# EAGLE design esp8266-lab-kit (EAGLE 7.5.0)
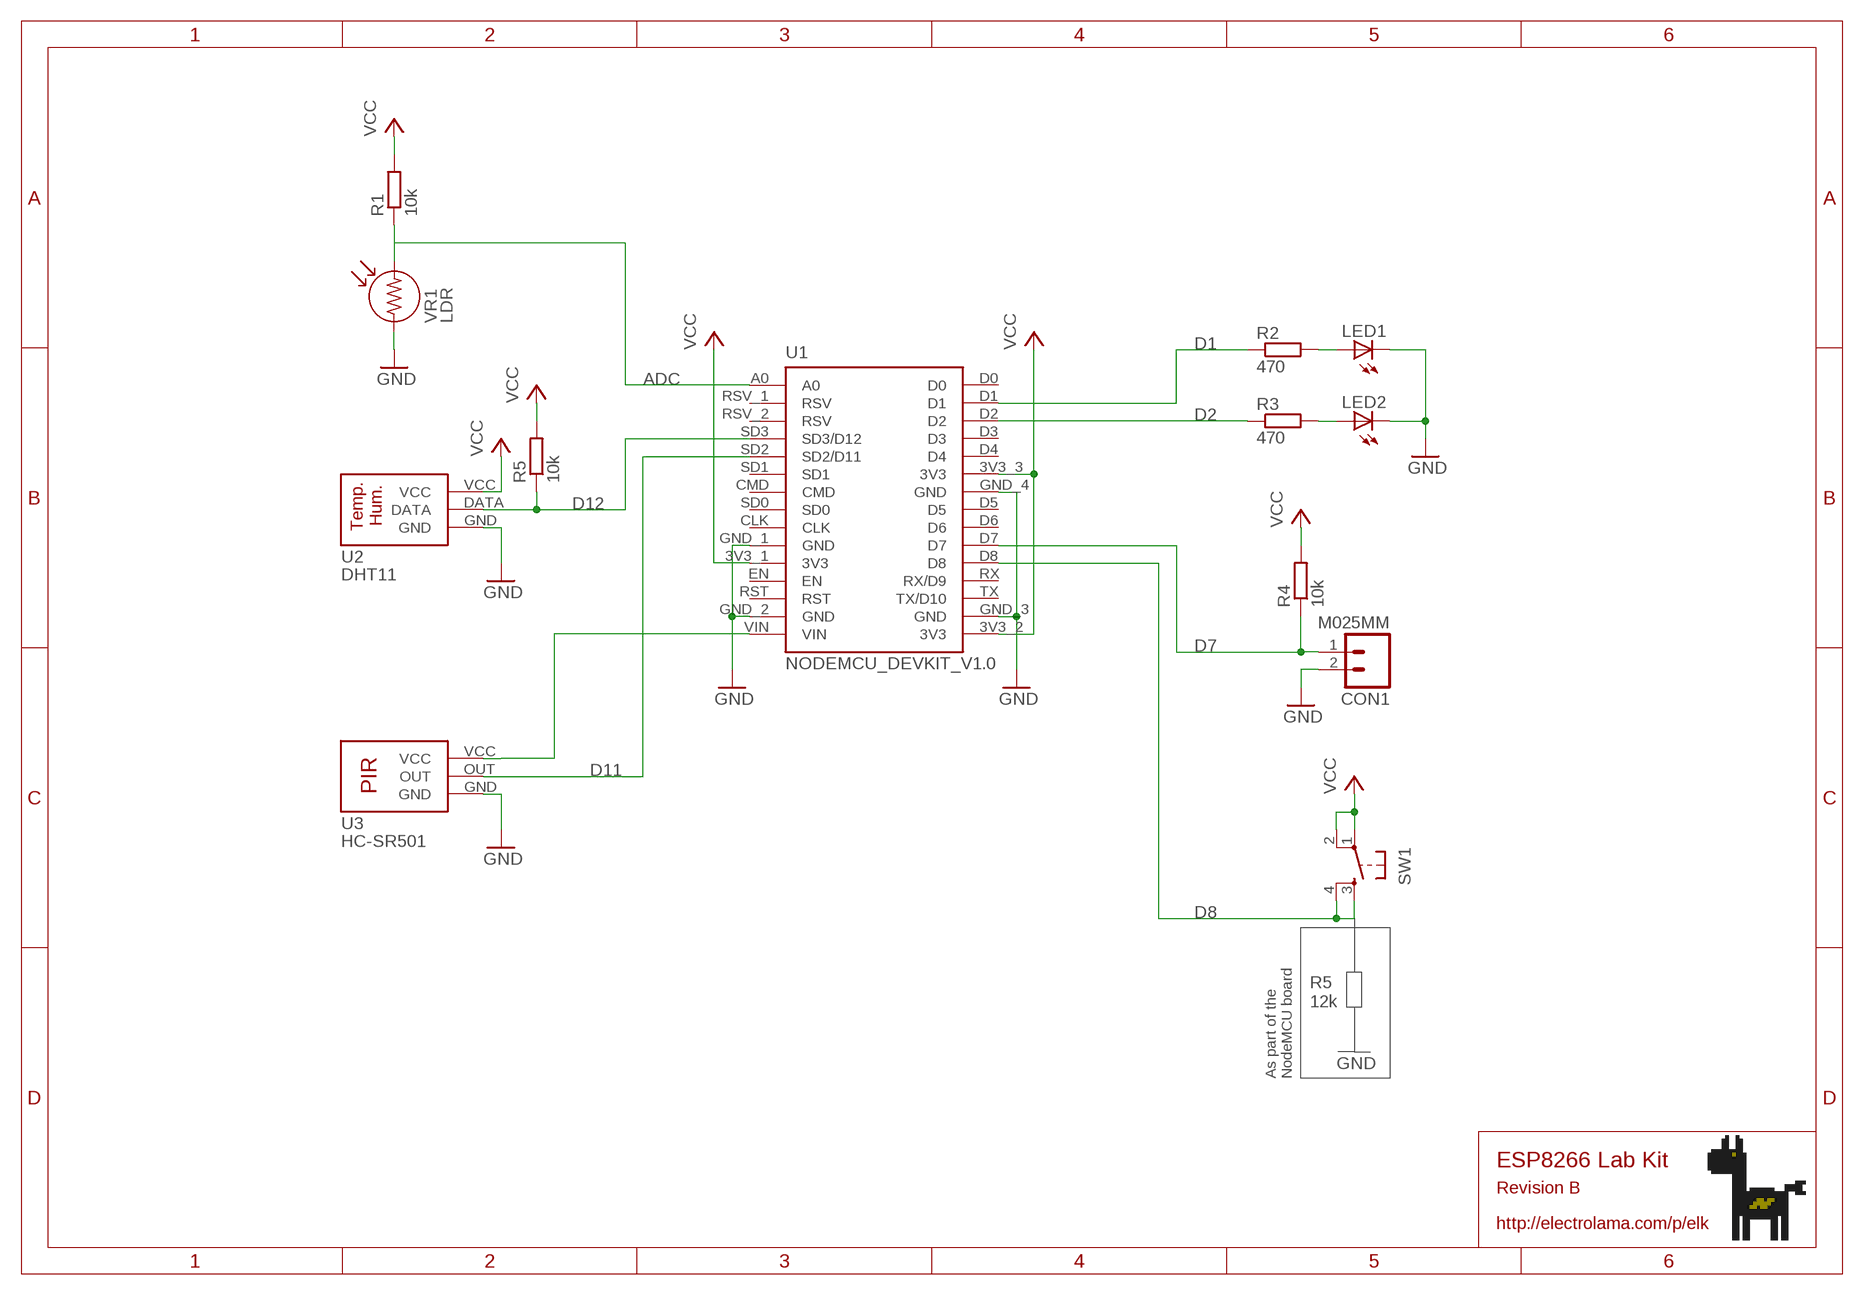
[diagram p0: schematic, sheet 1]

## Parts
CON1  M025MM  [SCREWTERMINAL-5MM-2]
LED1  LED5MM  [LED5MM]
LED2  LED5MM  [LED5MM]
R1  10k  RESISTOR-PTH-0.4  [RTH025W]
R2  470  RESISTOR-PTH-0.4  [RTH025W]
R3  470  RESISTOR-PTH-0.4  [RTH025W]
R4  10k  RESISTOR-PTH-0.4  [RTH025W]
R5  10k  RESISTOR-PTH-0.4  [RTH025W]
SW1  TAC_SWITCHPTH  [TACTILE-PTH]
U1  NODEMCU_DEVKIT_V1.0  [NODEMCU_DEVKIT_V1.0]
U2  DHT11  [DHT11]
U3  HC-SR501  [HC-SR501]
VR1  LDR  [LDR]

## Nets
ADC: R1.1 U1.A0 VR1.2
D1: R2.1 U1.D1
D2: R3.1 U1.D2
D7: CON1.1 R4.1 U1.D7
D8: SW1.3 SW1.4 U1.D8
D11: U1.SD2(SD2/D11) U3.OUT
D12: R5.1 U1.SD3(SD3/D12) U2.DATA
GND: CON1.2 LED1.K(C) LED2.K(C) U1.GND_1(GND) U1.GND_2(GND) U1.GND_3(GND) U1.GND_4(GND) U2.GND U3.GND VR1.1
N$1: LED1.A R2.2
N$2: LED2.A R3.2
N$3: U1.VIN U3.VCC
VCC: R1.2 R4.2 R5.2 SW1.1 SW1.2 U1.3V3_1(3V3) U1.3V3_2(3V3) U1.3V3_3(3V3) U2.VCC
Unconnected: U1.CLK U1.CMD U1.D0 U1.D3 U1.D4 U1.D5 U1.D6 U1.EN U1.RST U1.RSV_1(RSV) U1.RSV_2(RSV) U1.RX(RX/D9) U1.SD0 U1.SD1 U1.TX(TX/D10)

## Notes on the sheet
- R5
  12k
- GND
- As part of the
  NodeMCU board
- ESP8266 Lab Kit
- Revision B
- http://electrolama.com/p/elk

## Library data of the parts
CON1 = SparkFun-Connectors:M02: Standard 2-pin 0.1" header. Use with - straight break away headers ( PRT-00116) - right angle break away headers (PRT-00553) - swiss pins (PRT-00743) - machine pins (PRT-00117) - female headers (PRT-00115) Molex polarized connector foot print use with: PRT-08233 with associated crimp pins and housings. 2.54_SCREWTERM for use with PRT-10571. 3.5mm Screw Terminal footprints for PRT-08084 5mm Screw Terminal footprints for use with PRT-08433
LED1 LED2 = led:LED: LED OSRAM: - CHIPLED LG R971, LG N971, LY N971, LG Q971, LY Q971, LO R971, LY R971 LH N974, LH R974 LS Q976, LO Q976, LY Q976 LO Q996 - Hyper CHIPLED LW Q18S LB Q993, LB Q99A, LB R99A - SideLED LS A670, LO A670, LY A670, LG A670, LP A670 LB A673, LV A673, LT A673, LW A673 LH A674 LY A675 LS A676, LA A676, LO A676, LY A676, LW A676 LS A679, LY A679, LG A679 - Hyper Micro SIDELED® LS Y876, LA Y876, LO Y876, LY Y876 LT Y87S - SmartLED LW L88C, LW L88S LB L89C, LB L89S, LG L890 LS L89K, LO L89K, LY L89K LS L896, LA L896, LO L896, LY L896 - TOPLED LS T670, LO T670, LY T670, LG T670, LP T670 LSG T670, LSP T670, LSY T670, LOP T670, LYG T670 LG T671, LOG T671, LSG T671 LB T673, LV T673, LT T673, LW T673 LH T674 LS T676, LA T676, LO T676, LY T676, LB T676, LH T676, LSB T676, LW T676 LB T67C, LV T67C, LT T67C, LS T67K, LO T67K, LY T67K, LW E67C LS E67B, LA E67B, LO E67B, LY E67B, LB E67C, LV E67C, LT E67C LW T67C LS T679, LY T679, LG T679 LS T770, LO T770, LY T770, LG T770, LP T770 LB T773, LV T773, LT T773, LW T773 LH T774 LS E675, LA E675, LY E675, LS T675 LS T776, LA T776, LO T776, LY T776, LB T776 LHGB T686 LT T68C, LB T68C - Hyper Mini TOPLED® LB M676 - Mini TOPLED Santana® LG M470 LS M47K, LO M47K, LY M47K Source: http://www.osram.convergy.de LUXEON: - LUMILED® LXK2-PW12-R00, LXK2-PW12-S00, LXK2-PW14-U00, LXK2-PW14-V00 LXK2-PM12-R00, LXK2-PM12-S00, LXK2-PM14-U00 LXK2-PE12-Q00, LXK2-PE12-R00, LXK2-PE12-S00, LXK2-PE14-T00, LXK2-PE14-U00 LXK2-PB12-K00, LXK2-PB12-L00, LXK2-PB12-M00, LXK2-PB14-N00, LXK2-PB14-P00, LXK2-PB14-Q00 LXK2-PR12-L00, LXK2-PR12-M00, LXK2-PR14-Q00, LXK2-PR14-R00 LXK2-PD12-Q00, LXK2-PD12-R00, LXK2-PD12-S00 LXK2-PH12-R00, LXK2-PH12-S00 LXK2-PL12-P00, LXK2-PL12-Q00, LXK2-PL12-R00 Source: www.luxeon.com KINGBRIGHT: KA-3528ASYC Source: www.kingbright.com
R1-R5 = dp_devices:RESISTOR
SW1 = SparkFun-Electromechanical:TAC_SWITCH: Momentary Switch Button commonly used for reset or general input. Spark Fun Electronics SKU : COM-00097 SMT- SWCH-08247
U1 = ok:NODEMCU_DEVKIT_V1.0
U2 = ok:DHT11
U3 = ok:HC-SR501
VR1 = ok:LDR

## Board
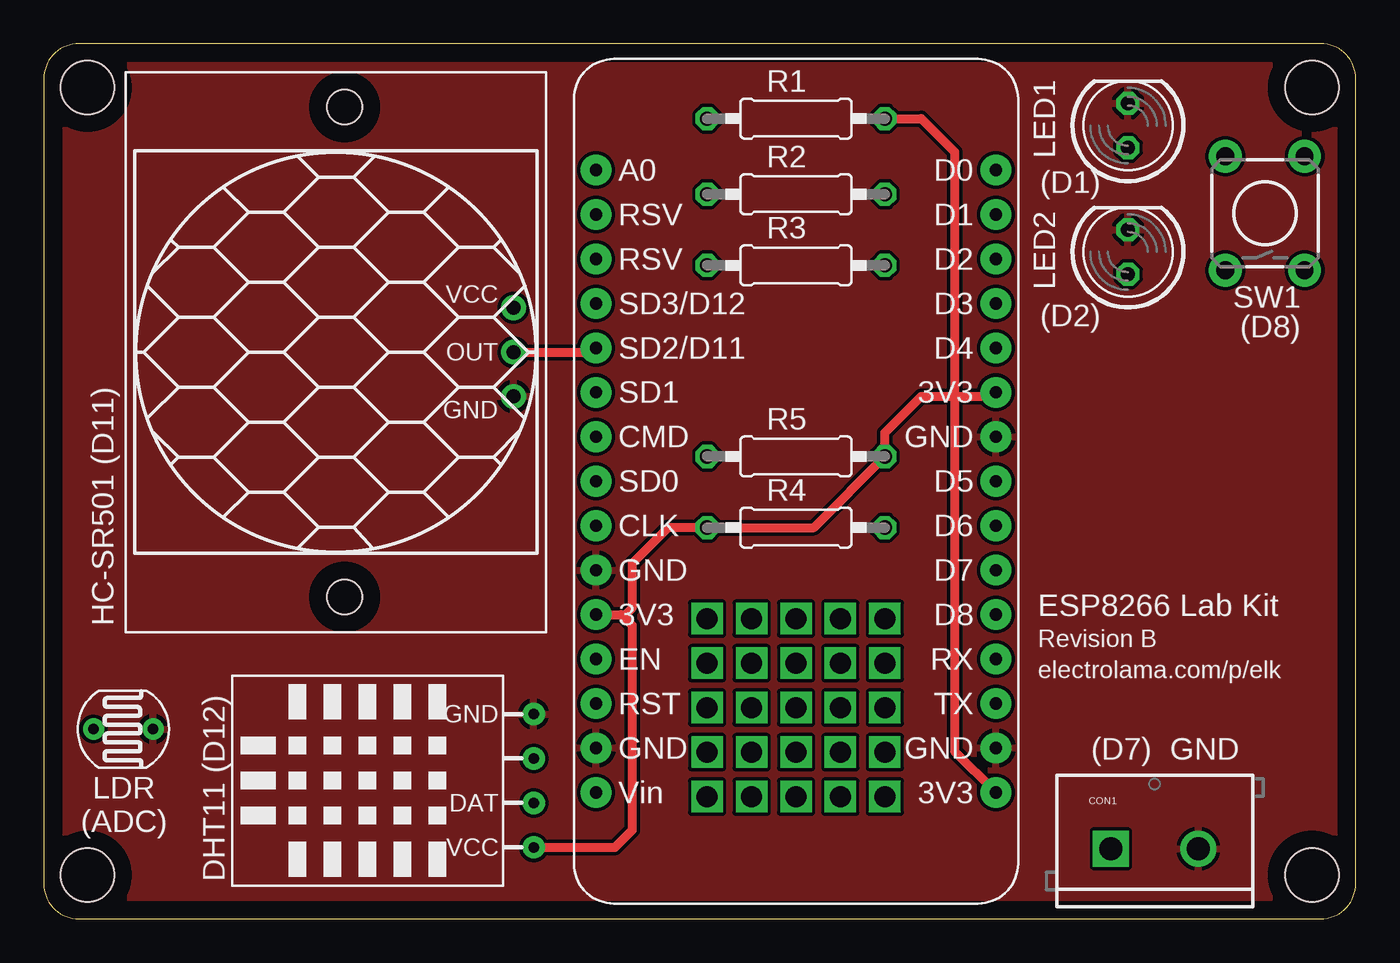
[diagram p1: board, top side]
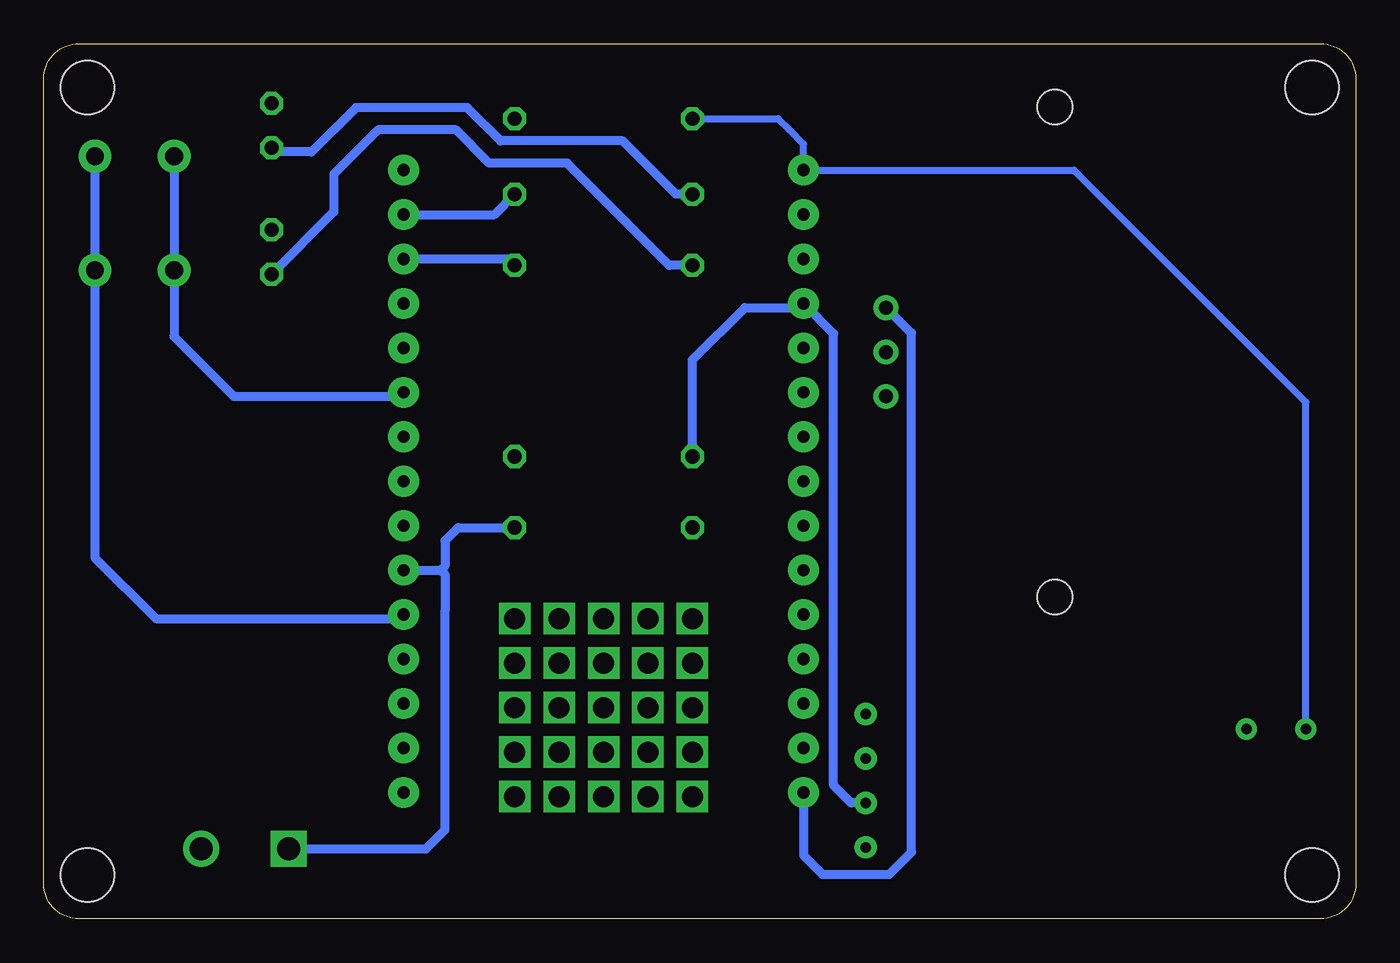
[diagram p2: board, bottom side, seen from below]

Size 75 x 50 mm. Coordinates in mm from the lower left corner, seen from the top.
Outline: 0,48 0,2 arc90 2,0 73,0 arc90 75,2 75,48 arc90 73,50 2,50 arc90 0,48
Copper layers (1*16): Top 0.035mm / dielectric 1.5mm / Bottom 0.035mm
Design rules "default": minimum track width 10mil, minimum drill 0.6mm, track to track 8mil, track to pad 8mil, pad to pad 8mil, via to via 8mil, smd to smd 8mil, copper to edge 40mil, drill to drill 8mil, minimum pad ring 10mil, minimum via ring 8mil, stop-mask expansion 4mil, vias tented up to drill 0mil, thermal gap 10mil
Holes 3.05 mm at 2.5,47.5 2.5,2.5 72.5,2.5 72.5,47.5

### Footprints (pad centres in the part's own frame; a part is rotated, then mirrored left to right if it is on the bottom)
SCREWTERMINAL-5MM-2 = drill 1.3 pad 2.032 square: 1 0,0 | drill 1.3 pad 2.032: 2 5,0
LED5MM = drill 0.813 octagon: A -1.27,0; K 1.27,0
RTH025W = drill 0.813 octagon: 1 -5.08,0; 2 5.08,0
TACTILE-PTH = drill 1.016 pad 1.88: 1 -3.251,2.261; 2 3.251,2.261; 3 -3.251,-2.261; 4 3.251,-2.261
NODEMCU_DEVKIT_V1.0 = drill 0.7 pad 1.752: 3V3_1 -11.43,-7.62; 3V3_2 11.43,-17.78; 3V3_3 11.43,5.08; A0 -11.43,17.78; CLK -11.43,-2.54; CMD -11.43,2.54; D0 11.43,17.78; D1 11.43,15.24; D2 11.43,12.7; D3 11.43,10.16; D4 11.43,7.62; D5 11.43,0; D6 11.43,-2.54; D7 11.43,-5.08; D8 11.43,-7.62; EN -11.43,-10.16; GND_1 -11.43,-5.08; GND_2 -11.43,-15.24; GND_3 11.43,-15.24; GND_4 11.43,2.54; RST -11.43,-12.7; RSV_1 -11.43,15.24; RSV_2 -11.43,12.7; RX 11.43,-10.16; SD0 -11.43,0; SD1 -11.43,5.08; SD2 -11.43,7.62; SD3 -11.43,10.16; TX 11.43,-12.7; VIN -11.43,-17.78
DHT11 = drill 0.6 pad 1.27: DATA -1.27,-9.5; GND 3.81,-9.5; N/C 1.27,-9.5; VCC -3.81,-9.5
HC-SR501 = drill 0.8 pad 1.422: GND -2.54,-10.16; OUT 0,-10.16; VCC 2.54,-10.16 | hole 2: -14,-0.5; 14,-0.5
PROTO_VIAS_05X05_1.2 = drill 1.2 square: 1 -5.08,5.08; 2 -2.54,5.08; 3 0,5.08; 4 2.54,5.08; 5 5.08,5.08; 6 -5.08,2.54; 7 -2.54,2.54; 8 0,2.54; 9 2.54,2.54; 10 5.08,2.54; 11 -5.08,0; 12 -2.54,0; 13 0,0; 14 2.54,0; 15 5.08,0; 16 -5.08,-2.54; 17 -2.54,-2.54; 18 0,-2.54; 19 2.54,-2.54; 20 5.08,-2.54; 21 -5.08,-5.08; 22 -2.54,-5.08; 23 0,-5.08; 24 2.54,-5.08; 25 5.08,-5.08
LDR = drill 0.6 pad 1.219: 1 0,1.7; 2 0,-1.7

### Placement (x,y rotation side)
CON1  61,4 0 top
LED1  61.98,45.32 90 top
LED2  61.98,38.1 90 top
R1  43,45.72 0 top
R2  43,41.4 180 top
R3  43,37.34 180 top
R4  43,22.35 180 top
R5  43,26.42 0 top
SW1  69.81,40.32 90 top
U1  43,25 0 top
U2  18.51,7.89 90 top
U3  16.7,32.38 90 top
U$1  PROTO_VIAS_05X05-1.2  [PROTO_VIAS_05X05_1.2]  43,12.06 180 top
VR1  4.55,10.84 270 top

### Tracks (layer width: path | path; a pad name or v marks a point on that pad's centre or on a via)
ADC
  Bottom 0.406: R1.1 33.02,45.72 32.38,45.09 31.57,44.27 U1.A0 16.11,42.78 15.88,42.55 2.85,29.52 VR1.2
D1
  Bottom 0.508: U1.D1 49.24,40.24 R2.1
D2
  Bottom 0.508: U1.D2 48.44,37.7 R3.1
D7
  Bottom 0.508: CON1.1 53.15,4 52.07,5.08 52.07,17.56 52.07,19.68 52.3,19.92 | U1.D7 52.3,19.92 | 52.3,19.92 52.07,20.16 52.07,21.59 51.31,22.35 R4.1
D8
  Bottom 0.508: U1.D8 54.66,17.14 68.58,17.14 72.07,20.64 SW1.3 SW1.4
D11
  Top 0.508: U3.OUT 31.34,32.38 U1.SD2
D12
  Bottom 0.508: R5.1 37.92,28.81 37.92,31.93 34.92,34.92 31.8,34.92 U1.SD3 29.84,33.44 29.84,7.62 28.84,6.62 U2.DATA
GND
  pour Top: 1,49 74,49 74,1 1,1
N$1
  Bottom 0.508: R2.2 38.86,41.4 41.91,44.45 48.9,44.45 50.8,46.35 57.15,46.35 59.69,43.81 61.74,43.81 LED1.A
N$2
  Bottom 0.508: R3.2 39.24,37.34 45.09,43.18 49.53,43.18 51.44,45.09 55.88,45.09 58.42,42.55 58.42,40.39 LED2.A
N$3
  Bottom 0.508: U1.VIN 31.57,3.63 30.48,2.54 26.67,2.54 25.4,3.81 25.4,33.47 U3.VCC
VCC
  Top 0.508: U2.VCC 32.66,4.08 33.66,5.08 33.66,15.29 33.66,16.75 33.02,17.38 | R1.2 50.16,45.72 52.07,43.81 52.07,29.84 | 52.07,29.84 52.07,9.58 U1.3V3_2 | 52.07,29.84 50.16,29.84 48.08,27.76 R5.2 44.02,22.35 R4.2 35.69,22.35 35.56,22.23 33.66,20.32 33.66,17.78 33.26,17.38 33.02,17.38 | 52.07,29.84 54.2,29.84 U1.3V3_3 | U1.3V3_1 33.02,17.38
  Bottom 0.508: SW1.2 SW1.1 67.55,33.26 64.14,29.84 54.66,29.84 U1.3V3_3

### Text on the board
tPlace: ESP8266 Lab Kit | Revision B | electrolama.com/p/elk
tNames: (D1) | (D2) | (D8) | HC-SR501 (D11) | (D7) GND | LDR / (ADC) | DHT11 (D12)